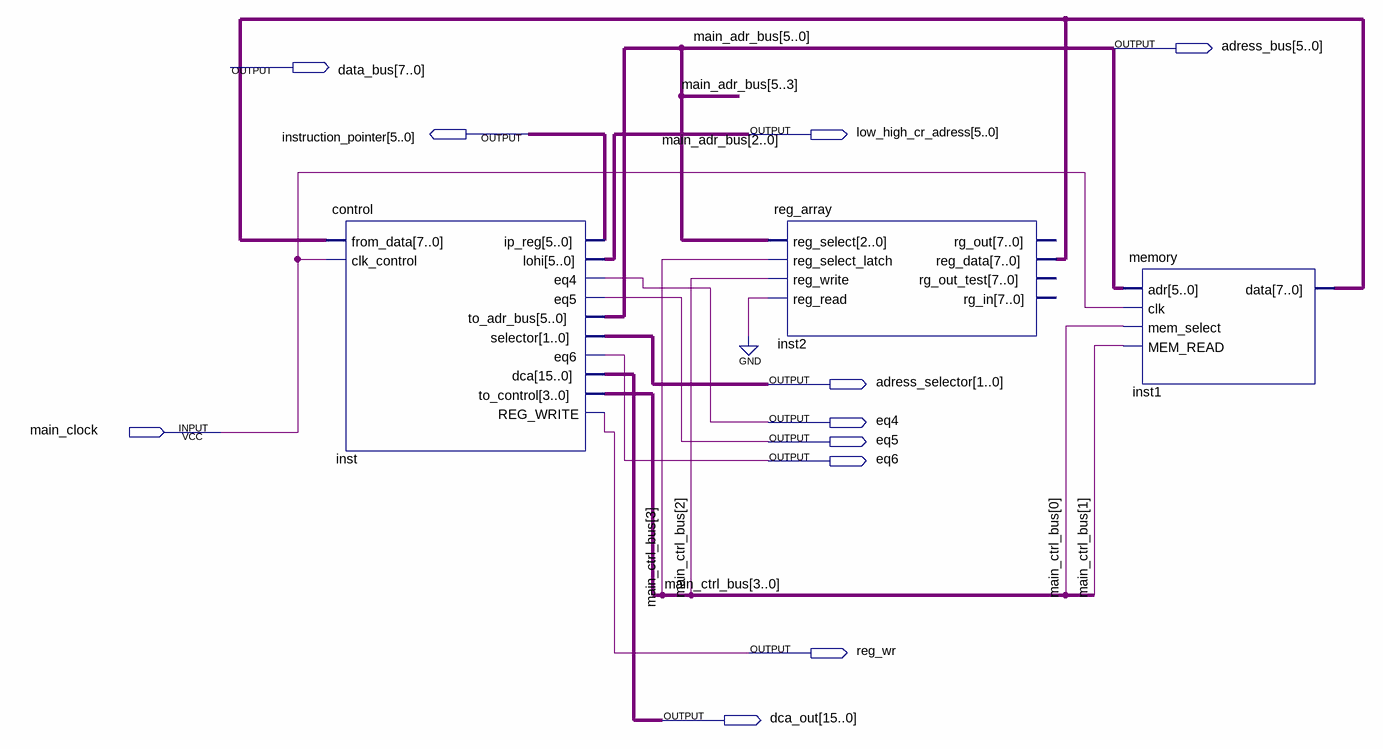
[diagram p0: schematic sheet]
// Quartus schematic main.bdf as structural Verilog: 3 symbols, 11 pins
module main (
  input  main_clock,
  output [5:0] adress_bus,
  output [7:0] data_bus,
  output [5:0] instruction_pointer,
  output [5:0] low_high_cr_adress,
  output [1:0] adress_selector,
  output eq4,
  output eq5,
  output eq6,
  output reg_wr,
  output [15:0] dca_out
);

  wire [3:0] main_ctrl_bus;
  wire [7:0] inst2_reg_data;

  control inst (
    .from_data(inst2_reg_data), .clk_control(main_clock), .ip_reg(instruction_pointer),
    .lohi(low_high_cr_adress), .eq4(eq4), .eq5(eq5), .to_adr_bus(adress_bus), .selector(adress_selector),
    .eq6(eq6), .dca(dca_out), .to_control(main_ctrl_bus), .REG_WRITE(reg_wr));
  reg_array inst2 (
    .reg_select(adress_bus[2:0]), .reg_select_latch(main_ctrl_bus[3]), .reg_write(main_ctrl_bus[2]),
    .reg_read(1'b0), .reg_data(inst2_reg_data));  // open: rg_out, rg_out_test, rg_in
  memory inst1 (
    .adr(adress_bus), .clk(main_clock), .mem_select(main_ctrl_bus[0]), .MEM_READ(main_ctrl_bus[1]),
    .data(inst2_reg_data));

  // Other names for the same wires on the sheet: main_adr_bus[5:0] = adress_bus
endmodule
